# EAGLE design PLACA Mina (EAGLE 6.6.0)
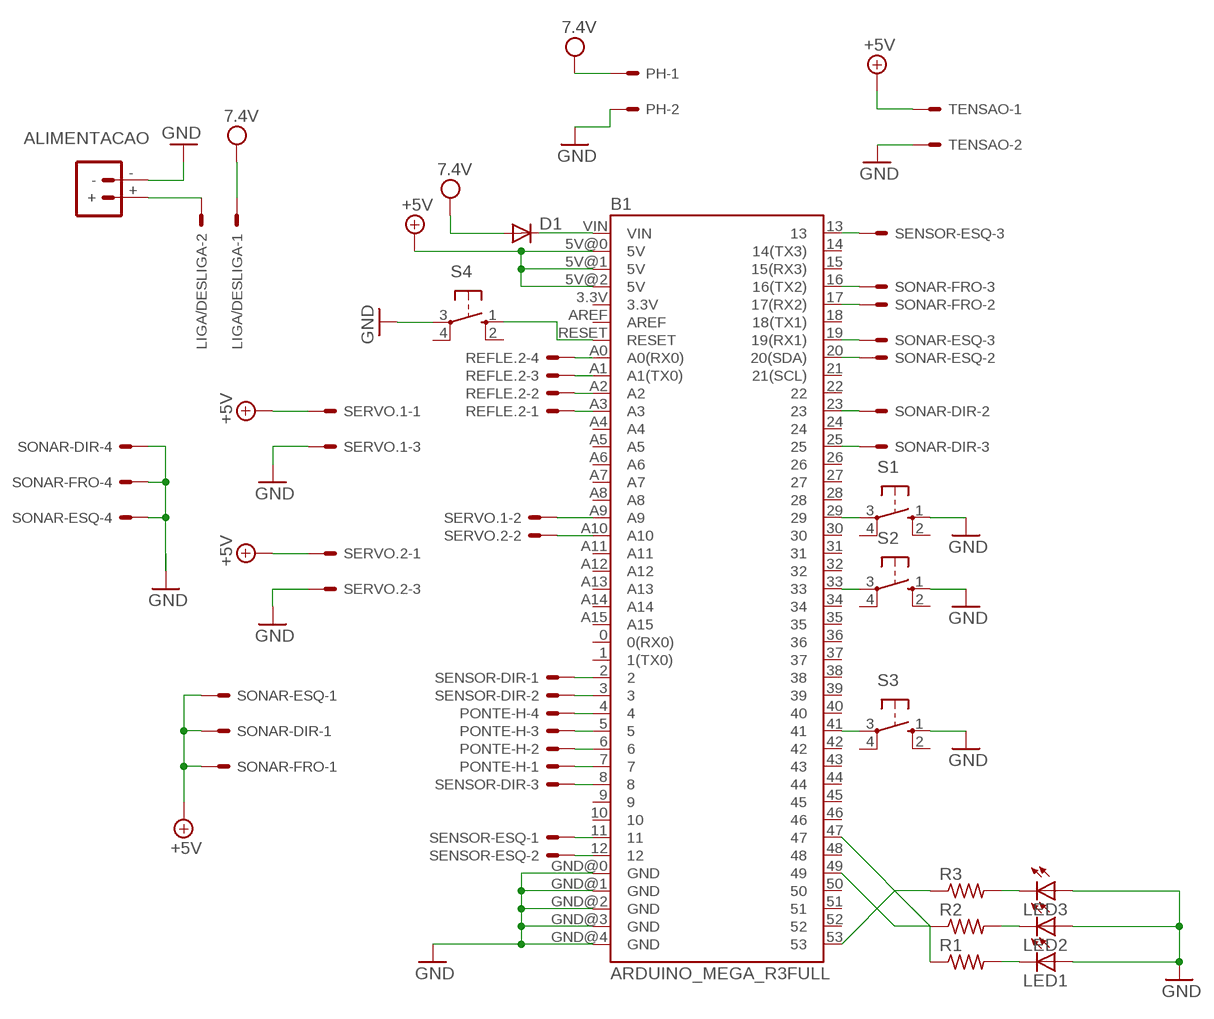
[diagram p0: schematic, sheet 1]

## Parts
ALIMENTACAO  BATTERY_CONNXT60  [XT60]
B1  ARDUINO_MEGA_R3FULL  [ARDUINO_MEGA]
D1  1N4004  [DO41-10]
LED1  LED5MM  [LED5MM]
LED2  LED5MM  [LED5MM]
LED3  LED5MM  [LED5MM]
LIGA/DESLIGA  CONN_0227-2021  [6410-02]
PH  CONN_0227-2021  [6410-02]
PONTE-H  CONN_0427-2041  [6410-04]
R1  R-US_0204/7  [0204/7]
R2  R-US_0204/7  [0204/7]
R3  R-US_0204/7  [0204/7]
REFLE.2  CONN_0427-2041  [6410-04]
S1  10-XX  [B3F-10XX]
S2  10-XX  [B3F-10XX]
S3  10-XX  [B3F-10XX]
S4  10-XX  [B3F-10XX]
SENSOR-DIR  CONN_0327-2031  [6410-03]
SENSOR-ESQ  CONN_0327-2031  [6410-03]
SERVO.1  CONN_0327-2031  [6410-03]
SERVO.2  CONN_0327-2031  [6410-03]
SONAR-DIR  CONN_0427-2041  [6410-04]
SONAR-ESQ  CONN_0427-2041  [6410-04]
SONAR-FRO  CONN_0427-2041  [6410-04]
TENSAO  CONN_0227-2021  [6410-02]

## Nets
+5V: B1.5V@0(5V) B1.5V@1(5V) B1.5V@2(5V) SERVO.1.1 SERVO.2.1 SONAR-DIR.1 SONAR-ESQ.1 SONAR-FRO.1 TENSAO.1
GND: ALIMENTACAO.- B1.GND@0(GND) B1.GND@1(GND) B1.GND@2(GND) B1.GND@3(GND) B1.GND@4(GND) LED1.A LED2.A LED3.A PH.2 S1.1(S) S2.1(S) S3.1(S) S4.3(P) SERVO.1.3 SERVO.2.3 SONAR-DIR.4 SONAR-ESQ.4 SONAR-FRO.4 TENSAO.2
N$1: B1.A3 REFLE.2.1
N$2: B1.A2 REFLE.2.2
N$3: B1.A1(A1(TX0)) REFLE.2.3
N$4: B1.A0(A0(RX0)) REFLE.2.4
N$5: B1.16(16(TX2)) SONAR-FRO.3
N$6: B1.17(17(RX2)) SONAR-FRO.2
N$7: B1.7 PONTE-H.1
N$8: B1.6 PONTE-H.2
N$9: B1.5 PONTE-H.3
N$10: B1.4 PONTE-H.4
N$11: B1.20(20(SDA)) SONAR-ESQ.2
N$12: B1.19(19(RX1)) SONAR-ESQ.3
N$13: B1.23 SONAR-DIR.2
N$14: B1.25 SONAR-DIR.3
N$15: B1.11 SENSOR-ESQ.1
N$16: B1.12 SENSOR-ESQ.2
N$17: B1.13 SENSOR-ESQ.3
N$18: B1.2 SENSOR-DIR.1
N$19: B1.3 SENSOR-DIR.2
N$20: B1.8 SENSOR-DIR.3
N$21: B1.A10 SERVO.2.2
N$22: B1.A9 SERVO.1.2
N$23: B1.29 S1.3(P)
N$24: B1.33 S2.3(P)
N$25: B1.41 S3.3(P)
N$26: B1.53 R3.1
N$27: B1.49 R2.1
N$28: B1.47 R1.1
N$29: LED1.K(C) R1.2
N$30: LED2.K(C) R2.2
N$31: LED3.K(C) R3.2
N$32: B1.VIN D1.C
N$33: ALIMENTACAO.+ LIGA/DESLIGA.2
N$34: B1.RESET S4.1(S)
VDD: D1.A LIGA/DESLIGA.1 PH.1 ; supply symbol labelled 7.4V
Unconnected: B1.0(0(RX0)) B1.1(1(TX0)) B1.3.3V B1.9 B1.10 B1.14(14(TX3)) B1.15(15(RX3)) B1.18(18(TX1)) B1.21(21(SCL)) B1.22 B1.24 B1.26 B1.27 B1.28 B1.30 B1.31 B1.32 B1.34 B1.35 B1.36 B1.37 B1.38 B1.39 B1.40 B1.42 B1.43 B1.44 B1.45 B1.46 B1.48 B1.50 B1.51 B1.52 B1.A4 B1.A5 B1.A6 B1.A7 B1.A8 B1.A11 B1.A12 B1.A13 B1.A14 B1.A15 B1.AREF S1.2(S1) S1.4(P1) S2.2(S1) S2.4(P1) S3.2(S1) S3.4(P1) S4.2(S1) S4.4(P1)

## Library data of the parts
ALIMENTACAO = Robotica-IFRN-SC-conectores:BATTERY_CONN: Battery Connectors Various footprints for battery connections
B1 = Robotica-IFRN-SC-Arduino:ARDUINO_MEGA_R3: Arduino Mega R3 ATmega2560 R3 compatible footprint. SparkFun Products: Arduino Mega 2560 R3 <https://www.sparkfun.com/products/11061>
D1 = diode:1N4004: DIODE general purpose rectifier, 1 A
LED1-LED3 = led:LED: LED OSRAM: - CHIPLED LG R971, LG N971, LY N971, LG Q971, LY Q971, LO R971, LY R971 LH N974, LH R974 LS Q976, LO Q976, LY Q976 LO Q996 - Hyper CHIPLED LW Q18S LB Q993, LB Q99A, LB R99A - SideLED LS A670, LO A670, LY A670, LG A670, LP A670 LB A673, LV A673, LT A673, LW A673 LH A674 LY A675 LS A676, LA A676, LO A676, LY A676, LW A676 LS A679, LY A679, LG A679 - Hyper Micro SIDELED® LS Y876, LA Y876, LO Y876, LY Y876 LT Y87S - SmartLED LW L88C, LW L88S LB L89C, LB L89S, LG L890 LS L89K, LO L89K, LY L89K LS L896, LA L896, LO L896, LY L896 - TOPLED LS T670, LO T670, LY T670, LG T670, LP T670 LSG T670, LSP T670, LSY T670, LOP T670, LYG T670 LG T671, LOG T671, LSG T671 LB T673, LV T673, LT T673, LW T673 LH T674 LS T676, LA T676, LO T676, LY T676, LB T676, LH T676, LSB T676, LW T676 LB T67C, LV T67C, LT T67C, LS T67K, LO T67K, LY T67K, LW E67C LS E67B, LA E67B, LO E67B, LY E67B, LB E67C, LV E67C, LT E67C LW T67C LS T679, LY T679, LG T679 LS T770, LO T770, LY T770, LG T770, LP T770 LB T773, LV T773, LT T773, LW T773 LH T774 LS E675, LA E675, LY E675, LS T675 LS T776, LA T776, LO T776, LY T776, LB T776 LHGB T686 LT T68C, LB T68C - Hyper Mini TOPLED® LB M676 - Mini TOPLED Santana® LG M470 LS M47K, LO M47K, LY M47K Source: http://www.osram.convergy.de LUXEON: - LUMILED® LXK2-PW12-R00, LXK2-PW12-S00, LXK2-PW14-U00, LXK2-PW14-V00 LXK2-PM12-R00, LXK2-PM12-S00, LXK2-PM14-U00 LXK2-PE12-Q00, LXK2-PE12-R00, LXK2-PE12-S00, LXK2-PE14-T00, LXK2-PE14-U00 LXK2-PB12-K00, LXK2-PB12-L00, LXK2-PB12-M00, LXK2-PB14-N00, LXK2-PB14-P00, LXK2-PB14-Q00 LXK2-PR12-L00, LXK2-PR12-M00, LXK2-PR14-Q00, LXK2-PR14-R00 LXK2-PD12-Q00, LXK2-PD12-R00, LXK2-PD12-S00 LXK2-PH12-R00, LXK2-PH12-S00 LXK2-PL12-P00, LXK2-PL12-Q00, LXK2-PL12-R00 Source: www.luxeon.com KINGBRIGHT: KA-3528ASYC Source: www.kingbright.com
LIGA/DESLIGA PH TENSAO = Robotica-IFRN-SC-conectores:CONN_02: CONNECTOR wire to board 2.54 mm (.1 inch) pitch header; OC_FARNELL: unknown; OC_NEWARK: unknown
PONTE-H REFLE.2 SONAR-DIR SONAR-ESQ SONAR-FRO = Robotica-IFRN-SC-conectores:CONN_04: CONNECTOR wire to board 2.54 mm (.1 inch) pitch header; OC_FARNELL: unknown; OC_NEWARK: unknown
R1-R3 = rcl:R-US_: RESISTOR, American symbol
S1-S4 = switch-omron:10-XX: OMRON SWITCH; MPN: B3F-1000; OC_FARNELL: 176432; OC_NEWARK: 36M3542
SENSOR-DIR SENSOR-ESQ SERVO.1 SERVO.2 = Robotica-IFRN-SC-conectores:CONN_03: CONNECTOR wire to board 2.54 mm (.1 inch) pitch header; OC_FARNELL: unknown; OC_NEWARK: unknown

## Board
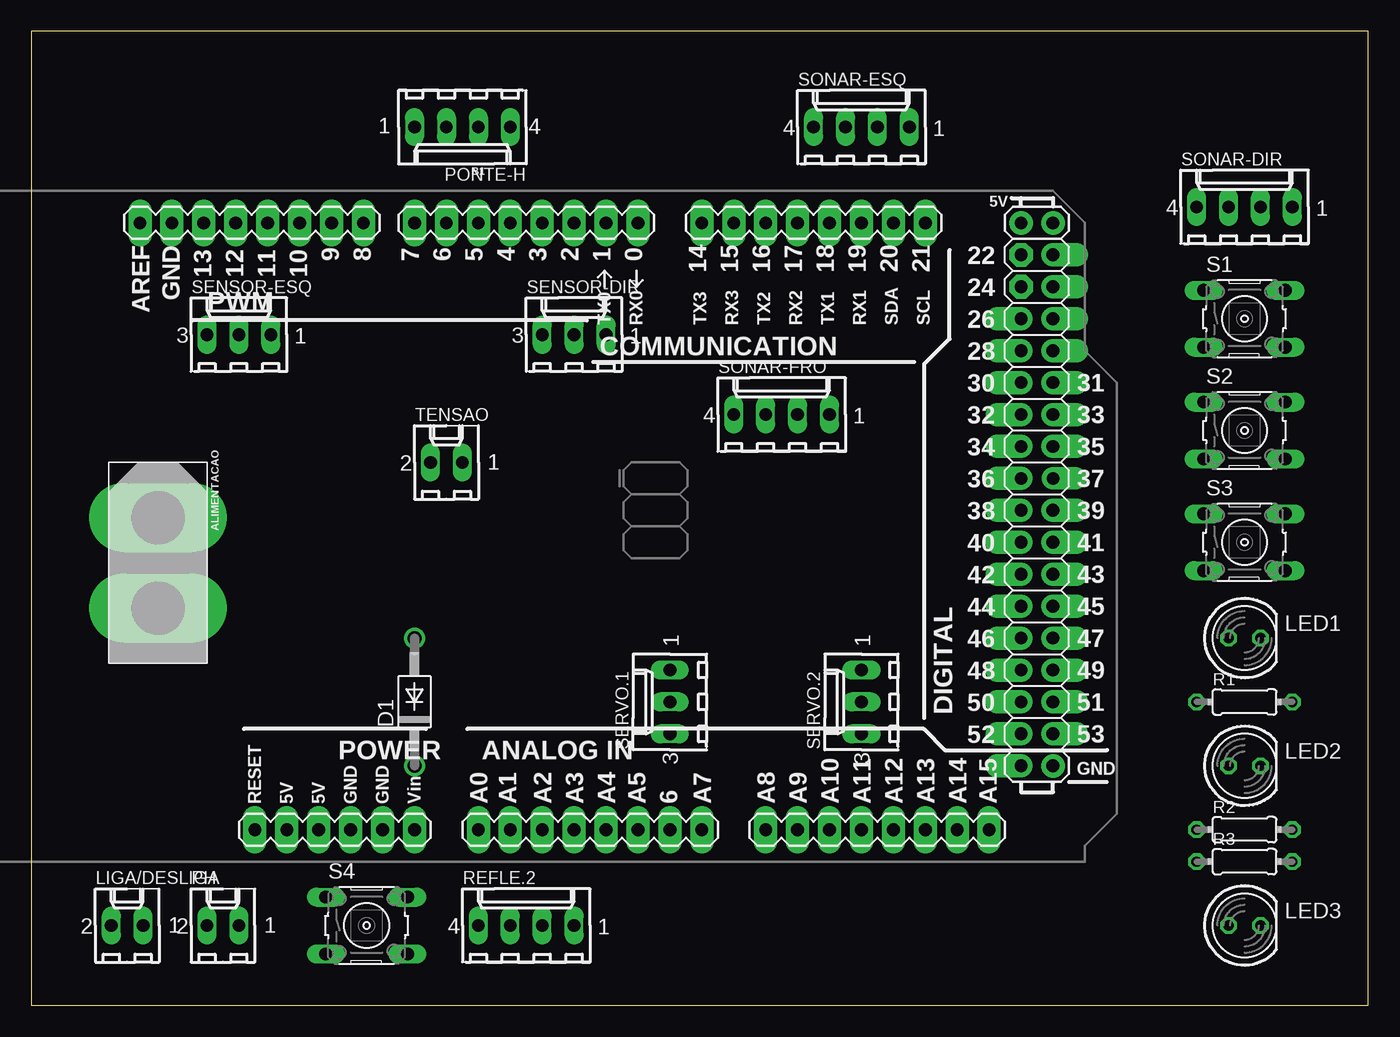
[diagram p1: board, top side]
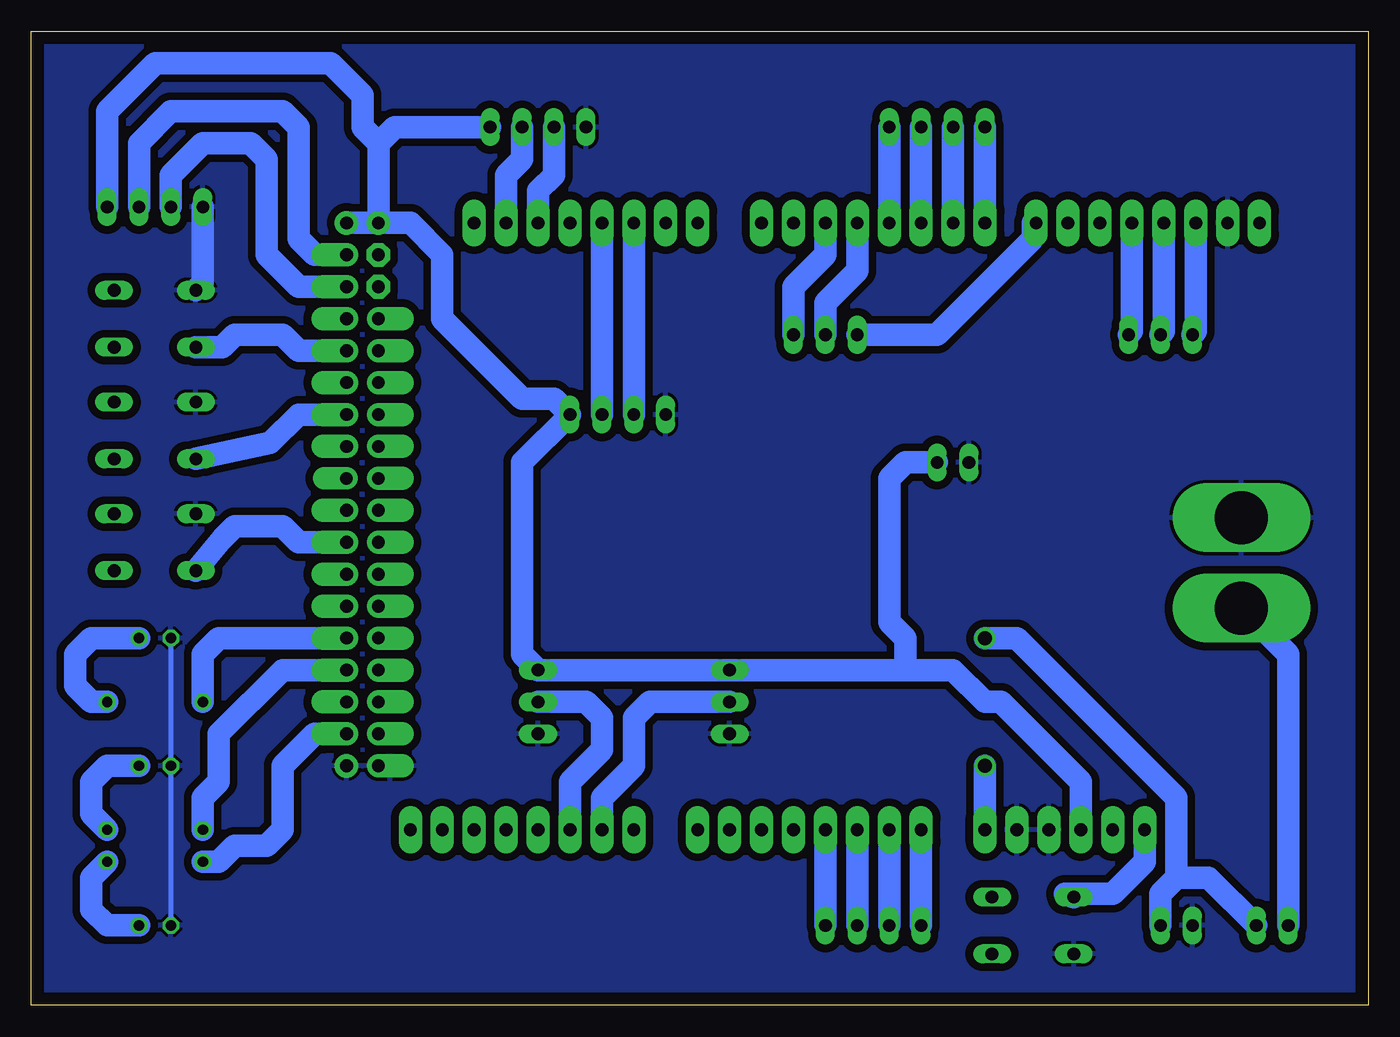
[diagram p2: board, bottom side, seen from below]

Size 106.35 x 77.46 mm. Coordinates in mm from the lower left corner, seen from the top.
Outline: 0,0 106.35,0 106.35,77.46 0,77.46 0,0
Copper layers (1*16): Top 0.035mm / dielectric 1.5mm / Bottom 0.035mm
Design rules "default *": minimum track width 70mil, minimum drill 24mil, track to track 24mil, track to pad 24mil, pad to pad 24mil, via to via 24mil, smd to smd 8mil, copper to edge 40mil, drill to drill 8mil, minimum pad ring 10mil, minimum via ring 8mil, stop-mask expansion 4mil, vias tented up to drill 0mil, thermal gap 10mil

### Footprints (pad centres in the part's own frame; a part is rotated, then mirrored left to right if it is on the bottom)
XT60 = drill 4.2 pad 5.5 long: + 6.51,-1.35; - -0.69,-1.35
ARDUINO_MEGA = drill 1.016 pad 1.88 long: 0 13.97,24.13; 1 11.43,24.13; 2 8.89,24.13; 3 6.35,24.13; 3.3V -13.97,-24.13; 4 3.81,24.13; 5 1.27,24.13; 5V@0 -11.43,-24.13; 6 -1.27,24.13; 7 -3.81,24.13; 8 -7.874,24.13; 9 -10.414,24.13; 10 -12.954,24.13; 11 -15.494,24.13; 12 -18.034,24.13; 13 -20.574,24.13; 14 19.05,24.13; 15 21.59,24.13; 16 24.13,24.13; 17 26.67,24.13; 18 29.21,24.13; 19 31.75,24.13; 20 34.29,24.13; 21 36.83,24.13; A0 1.27,-24.13; A1 3.81,-24.13; A2 6.35,-24.13; A3 8.89,-24.13; A4 11.43,-24.13; A5 13.97,-24.13; A6 16.51,-24.13; A7 19.05,-24.13; A8 24.13,-24.13; A9 26.67,-24.13; A10 29.21,-24.13; A11 31.75,-24.13; A12 34.29,-24.13; A13 36.83,-24.13; A14 39.37,-24.13; A15 41.91,-24.13; AREF -25.654,24.13; GND@0 -8.89,-24.13; GND@1 -6.35,-24.13; GND@4 -23.114,24.13; RESET -16.51,-24.13; VIN -3.81,-24.13 | drill 1.016 pad 1.88: 5V@1 44.45,24.13; 5V@2 46.99,24.13; GND@3 46.99,-19.05 | drill 1.016 pad 1.88 octagon: 22 44.45,21.59; 24 44.45,19.05 | drill 1.016 pad 1.88 offset: 23 46.99,21.59; 25 46.99,19.05; 26 44.45,16.51; 27 46.99,16.51; 28 44.45,13.97; 29 46.99,13.97; 30 44.45,11.43; 31 46.99,11.43; 32 44.45,8.89; 33 46.99,8.89; 34 44.45,6.35; 35 46.99,6.35; 36 44.45,3.81; 38 44.45,1.27; 39 46.99,1.27; 40 44.45,-1.27; 41 46.99,-1.27; 42 44.45,-3.81; 43 46.99,-3.81; 44 44.45,-6.35; 45 46.99,-6.35; 46 44.45,-8.89; 47 46.99,-8.89; 48 44.45,-11.43; 49 46.99,-11.43; 50 44.45,-13.97; 51 46.99,-13.97; 52 44.45,-16.51; 53 46.99,-16.51; GND@2 44.45,-19.05 | drill 1 pad 1.778 offset: 37 46.99,3.81
DO41-10 = drill 1.118: A 5.08,0; C -5.08,0
LED5MM = drill 0.813 octagon: A -1.27,0; K 1.27,0
6410-02 = drill 1.016 long: 1 1.27,0; 2 -1.27,0
6410-04 = drill 1.016 long: 1 3.81,0; 2 1.27,0; 3 -1.27,0; 4 -3.81,0
0204/7 = drill 0.813 octagon: 1 -3.81,0; 2 3.81,0
B3F-10XX = drill 1.016 long: 1 -3.251,2.261; 2 3.251,2.261; 3 -3.251,-2.261; 4 3.251,-2.261
6410-03 = drill 1.016 long: 1 2.54,0; 2 0,0; 3 -2.54,0

### Placement (x,y rotation side)
ALIMENTACAO  11.43,38.1 270 top
B1  34.29,38.1 0 top
D1  30.48,24.13 90 top
LED1  96.52,29.21 0 top
LED2  96.52,19.05 0 top
LED3  96.52,6.35 0 top
LIGA/DESLIGA  7.62,6.35 0 top
PH  15.24,6.35 0 top
PONTE-H  34.29,69.85 180 top
R1  96.52,24.13 0 top
R2  96.52,13.97 0 top
R3  96.52,11.43 0 top
REFLE.2  39.37,6.35 0 top
S1  96.52,54.61 0 top
S2  96.52,45.72 0 top
S3  96.52,36.83 0 top
S4  26.67,6.35 0 top
SENSOR-DIR  43.18,53.34 0 top
SENSOR-ESQ  16.51,53.34 0 top
SERVO.1  50.8,24.13 90 top
SERVO.2  66.04,24.13 90 top
SONAR-DIR  96.52,63.5 0 top
SONAR-ESQ  66.04,69.85 0 top
SONAR-FRO  59.69,46.99 0 top
TENSAO  33.02,43.18 0 top

### Tracks (layer width: path | path; a pad name or v marks a point on that pad's centre or on a via)
+5V
  Bottom 1.778: B1.5V@1 B1.5V@2 | SONAR-DIR.1 100.33,71.12 96.52,74.93 82.55,74.93 80.01,72.39 80.01,69.85 78.74,68.58 | B1.5V@1 78.74,68.58 | 78.74,68.58 77.47,69.85 SONAR-ESQ.1 | B1.5V@1 76.2,62.23 73.66,59.69 73.66,54.61 67.31,48.26 64.77,48.26 SONAR-FRO.1 67.31,43.18 67.31,27.94 SERVO.2.1 SERVO.1.1 36.83,26.67 | B1.5V@0 22.86,17.78 29.21,24.13 30.48,24.13 33.02,26.67 36.83,26.67 | TENSAO.1 36.83,43.18 38.1,41.91 38.1,30.48 36.83,29.21 36.83,26.67
GND
  Bottom 0.406: LED1.A LED2.A LED3.A
  Bottom 1.778: S1.1 92.71,57.43 SONAR-DIR.4
  pour Bottom: 1.27,87.63 1.27,0 106.68,1.27 107.95,87.63
N$1
  Bottom 1.778: B1.A3 REFLE.2.1
N$2
  Bottom 1.778: B1.A2 REFLE.2.2
N$3
  Bottom 1.778: B1.A1 REFLE.2.3
N$4
  Bottom 1.778: B1.A0 REFLE.2.4
N$5
  Bottom 1.778: B1.16 SONAR-FRO.3
N$6
  Bottom 1.778: B1.17 SONAR-FRO.2
N$7
  Bottom 1.778: B1.7 PONTE-H.1
N$8
  Bottom 1.778: B1.6 PONTE-H.2
N$9
  Bottom 1.778: B1.5 PONTE-H.3
N$10
  Bottom 1.778: B1.4 PONTE-H.4
N$11
  Bottom 1.778: SONAR-ESQ.2 67.31,67.31 68.58,66.04 B1.20
N$12
  Bottom 1.778: SONAR-ESQ.3 64.77,66.04 66.04,64.77 B1.19
N$13
  Bottom 1.778: B1.23 83.82,59.69 85.09,60.96 85.09,69.85 86.36,71.12 95.25,71.12 97.79,68.58 SONAR-DIR.2
N$14
  Bottom 1.778: B1.25 85.09,57.15 87.63,59.69 87.63,67.31 88.9,68.58 92.71,68.58 95.25,66.04 SONAR-DIR.3
N$15
  Bottom 1.778: SENSOR-ESQ.1 18.8,53.59 B1.11
N$16
  Bottom 1.778: SENSOR-ESQ.2 16.26,53.59 B1.12
N$17
  Bottom 1.778: SENSOR-ESQ.3 13.72,53.59 B1.13
N$18
  Bottom 1.778: SENSOR-DIR.1 45.72,57.15 43.18,59.69 B1.2
N$19
  Bottom 1.778: SENSOR-DIR.2 43.18,55.88 40.64,58.42 B1.3
N$20
  Bottom 1.778: SENSOR-DIR.3 34.29,53.34 26.67,60.96 26.67,62.23 B1.8
N$21
  Bottom 1.778: B1.A10 63.5,17.78 60.96,20.32 60.96,22.86 62.23,24.13 SERVO.2.2
N$22
  Bottom 1.778: B1.A9 60.96,16.51 58.42,19.05 58.42,22.86 57.15,24.13 SERVO.1.2
N$23
  Bottom 1.778: B1.29 85.09,52.07 86.36,53.34 90.17,53.34 91.16,52.35 S1.3
N$24
  Bottom 1.778: B1.33 85.09,46.99 87.35,44.73 S2.3
N$25
  Bottom 0.406: B1.41 83.11,36.83
  Bottom 1.778: 83.11,36.83 85.09,36.83 86.36,38.1 90.17,38.1 91.16,37.11 S3.3
N$26
  Bottom 1.778: R3.1 91.44,11.43 90.17,12.7 87.63,12.7 86.36,13.97 86.36,19.05 83.82,21.59 B1.53
N$27
  Bottom 1.778: R2.1 92.71,16.51 91.44,17.78 91.44,21.59 86.36,26.67 B1.49
N$28
  Bottom 1.778: R1.1 92.71,27.94 91.44,29.21 B1.47
N$29
  Bottom 1.778: R1.2 101.6,24.13 102.87,25.4 102.87,27.94 101.6,29.21 LED1.K
N$30
  Bottom 1.778: R2.2 101.6,15.24 101.6,17.78 100.33,19.05 LED2.K
N$31
  Bottom 1.778: LED3.K 100.33,6.35 101.6,7.62 101.6,10.16 R3.2
N$32
  Bottom 1.778: D1.C B1.VIN
N$33
  Bottom 1.778: LIGA/DESLIGA.2 6.35,27.94 8.89,30.48 ALIMENTACAO.+
N$34
  Bottom 1.778: B1.RESET 17.78,11.43 20.32,8.89 24.13,8.89 S4.1
N$35
  pour Bottom: 0,77.47 0,0 106.68,0 106.68,77.47
VDD
  Bottom 1.778: LIGA/DESLIGA.1 12.7,10.16 15.24,10.16 | 15.24,10.16 16.51,8.89 PH.1 | D1.A 27.94,29.21 15.24,16.51 15.24,10.16